# Altium schematic sheet SmartDevice.SchDoc: Wi-Fi vezérlésű okos eszköz
size A4; Author: Bencsik Dániel Zoltán; Organization: BME VIK AUT; DocumentNumber: 1; SheetNumber: 1; SheetTotal: 1
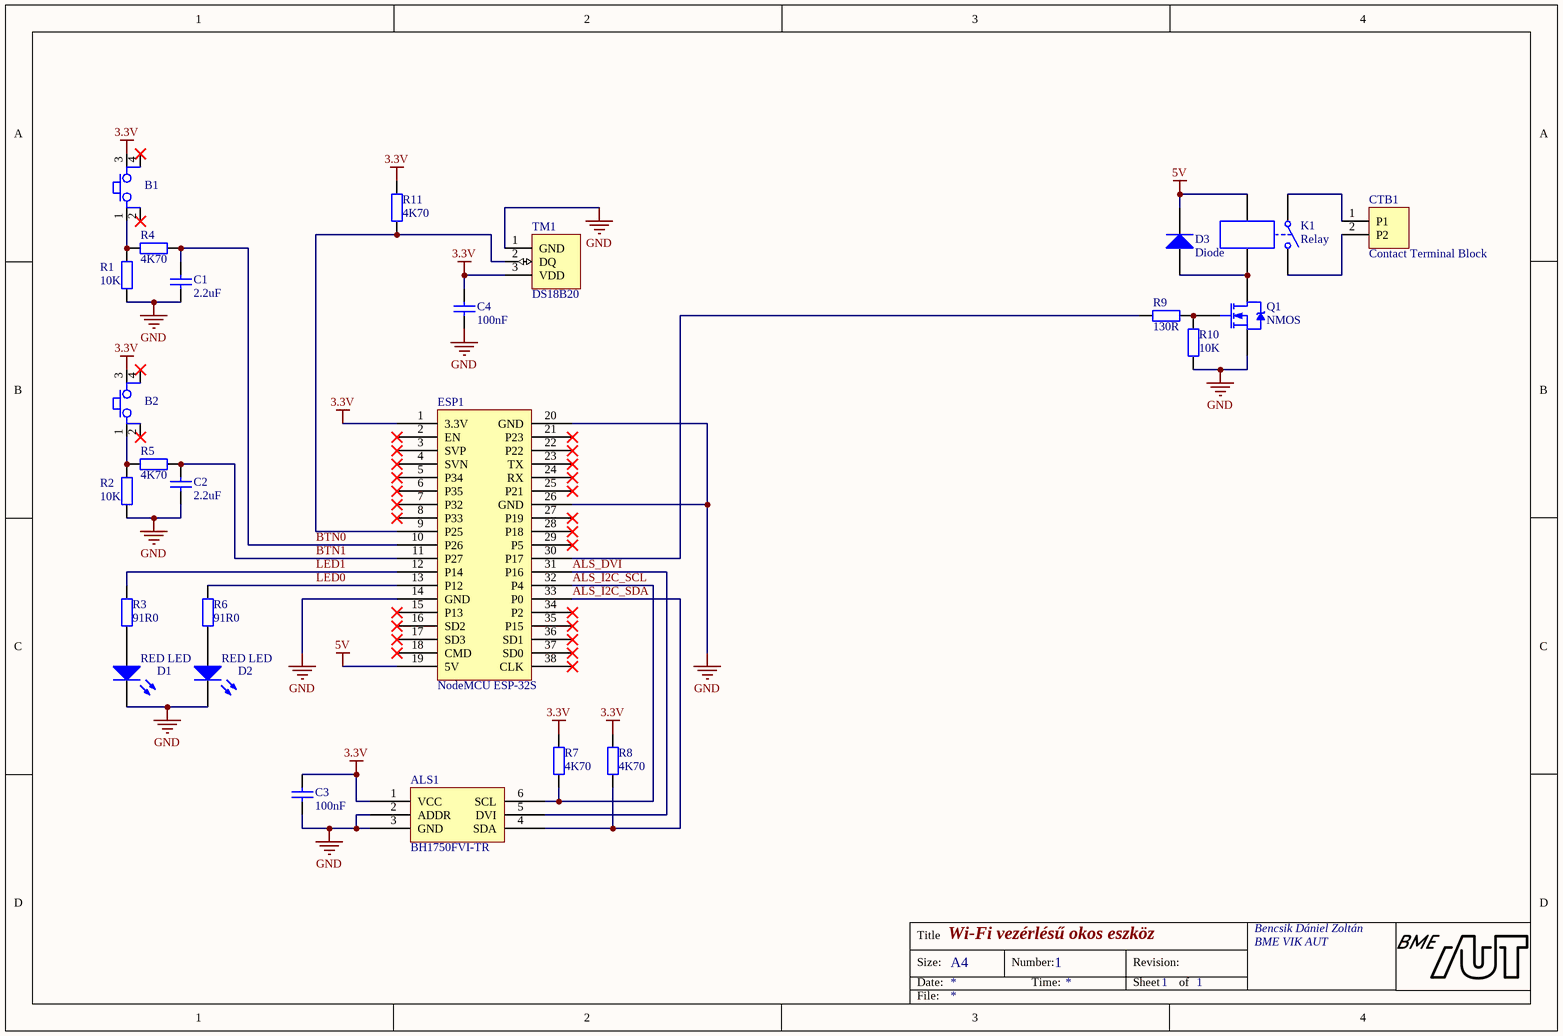
[diagram p0: SmartDevice.SchDoc]

## Parts
ALS1  BH1750FVI-TR  [ONLAB_BH1750FVI-TR]
B1  Button  [FP_BTN_SMD]  (value not drawn)
B2  Button  [FP_BTN_SMD]  (value not drawn)
C1  2.2uF  [FP_0805_CAP_085]
C2  2.2uF  [FP_0805_CAP_085]
C3  100nF  [FP_0805_CAP_085]
C4  100nF  [FP_0805_CAP_085]
CTB1  Contact Terminal Block  [ONLAB_SORK_2_RN3.50]
D1  RED LED  [FP_0805_LED_RED]
D2  RED LED  [FP_0805_LED_RED]
D3  Diode  [ONLAB_SMA_DO-214AC]
ESP1  NodeMCU ESP-32S  [ONLAB_ESP32-DEVKITC-32D]
K1  Relay  [ONLAB_RELAY_ALQ305]
Q1  NMOS  [ONLAB_2N7002_SOT23127P600-8N]
R1  10K  [FP_0805_RES]
R2  10K  [FP_0805_RES]
R3  91R0  [FP_0805_RES]
R4  4K70  [FP_0805_RES]
R5  4K70  [FP_0805_RES]
R6  91R0  [FP_0805_RES]
R7  4K70  [FP_0805_RES]
R8  4K70  [FP_0805_RES]
R9  130R  [FP_0805_RES]
R10  10K  [FP_0805_RES]
R11  4K70  [FP_0603_RES]
TM1  DS18B20  [ONLAB_DS18B20+]

## Nets
3.3V: ALS1.1(VCC) B1.3 B2.3 C3.2 C4.2 ESP1.1(3.3V) R7.2 R8.2 R11.2 TM1.3(VDD)
5V: D3.2(K) ESP1.19(5V) K1.3
GND: ALS1.2(ADDR) ALS1.3(GND) C1.1 C2.1 C3.1 C4.1 D1.K D2.K ESP1.14(GND) ESP1.20(GND) ESP1.26(GND) Q1.3(S) R1.1 R2.1 R10.1 TM1.1(GND)
ALS_DVI: ALS1.5(DVI) ESP1.31(P16)
ALS_I2C_SCL: ALS1.6(SCL) ESP1.32(P4) R7.1
ALS_I2C_SDA: ALS1.4(SDA) ESP1.33(P0) R8.1
BTN0: C1.2 ESP1.10(P26) R4.2
BTN1: C2.2 ESP1.11(P27) R5.2
LED0: ESP1.13(P12) R6.1
LED1: ESP1.12(P14) R3.1
NetB1_1: B1.1 R1.2 R4.1
NetB2_1: B2.1 R2.2 R5.1
NetCTB1_1: CTB1.1(P1) K1.1
NetCTB1_2: CTB1.2(P2) K1.2
NetD1_A: D1.A R3.2
NetD2_A: D2.A R6.2
NetD3_1: D3.1(A) K1.4 Q1.2(D)
NetESP1_9: ESP1.9(P25) R11.1 TM1.2(DQ)
NetESP1_30: ESP1.30(P17) R9.1
NetQ1_1: Q1.1(G) R9.2 R10.2

Not connected (* = marked no-connect by the designer): B1 2* 4*; B2 2* 4*; ESP1 2(EN)* 3(SVP)* 4(SVN)* 5(P34)* 6(P35)* 7(P32)* 8(P33)* 15(P13)* 16(SD2)* 17(SD3)* 18(CMD)* 21(P23)* 22(P22)* 23(TX)* 24(RX)* 25(P21)* 27(P19)* 28(P18)* 29(P5)* 34(P2)* 35(P15)* 36(SD1)* 37(SD0)* 38(CLK)*

## Notes on the sheet
- Title
- Size:
- Date:
- A4
- Number:
- Time:
- Revision:
- Sheet
- of
- File:

## Library data of the parts
ALS1 = BH1750FVI-TR: Digital 16bit Serial Output Type Ambient Light Sensor IC
B1 B2 = Button 4P: Push button
C1-C4 = CAP: Capacitor
  C1 C2: Value: 2.2uF
  C3 C4: Value: 100nF
CTB1 = CTB: SORKAPOCS 2 P RM3.50 CPP3.5/2 (STE) LIFTES 1mmř 10A
D1 D2 = LED: Typical RED GaAs LED
D3 = Diode: Default Diode; pin to pad: 1>A 2>K; Published: 8-Jun-2000; LatestRevisionDate: 17-Jul-2002; LatestRevisionNote: Re-released for DXP Platform.; PackageVersion: Sep-1996; PackageReference: SMC; Publisher: Altium Limited; PackageDescription: DO-214-AB/SMC; 2 C-Bend Leads; Body 7.9 x 5.9 mm, inc. leads (LxW); Code_JEDEC: DO-214-AB
ESP1 = NodeMCU ESP-32S: NodeMCU ESP32 Wireless & / Bluetooth Development Board
K1 = Relay-SPST: Single-Pole Single-Throw Relay; pin to pad: 1>COM 2>NO 3>C2 4>C1; Published: 24-Mar-1999; LatestRevisionDate: 17-Jul-2002; LatestRevisionNote: Re-released for DXP Platform.; PackageReference: MODULE4; Publisher: Altium Limited
Q1 = NMOS: NXP - BSP030,115 - MOSFET, N CH, 30V, 10A, SOT223; pin to pad: 1>G 2>D 3>S
R1-R11 = RES: Resistor
  R1 R2 R10: Value: 10K
  R3 R6: Value: 91R0
  R4 R5 R7 R8 R11: Value: 4K70
  R9: Value: 130R
TM1 = DS18B20: Programmable Resolution 1-Wire Digital Thermometer